# Altium project ZYNQ-HS-DEV.PrjPcb (part 4 of 4)

## Sheet ZHSD-POWER.SchDoc
size 420 x 297 mm; DocumentNumber: 1; SheetNumber: 2; SheetTotal: 17; Size: A3
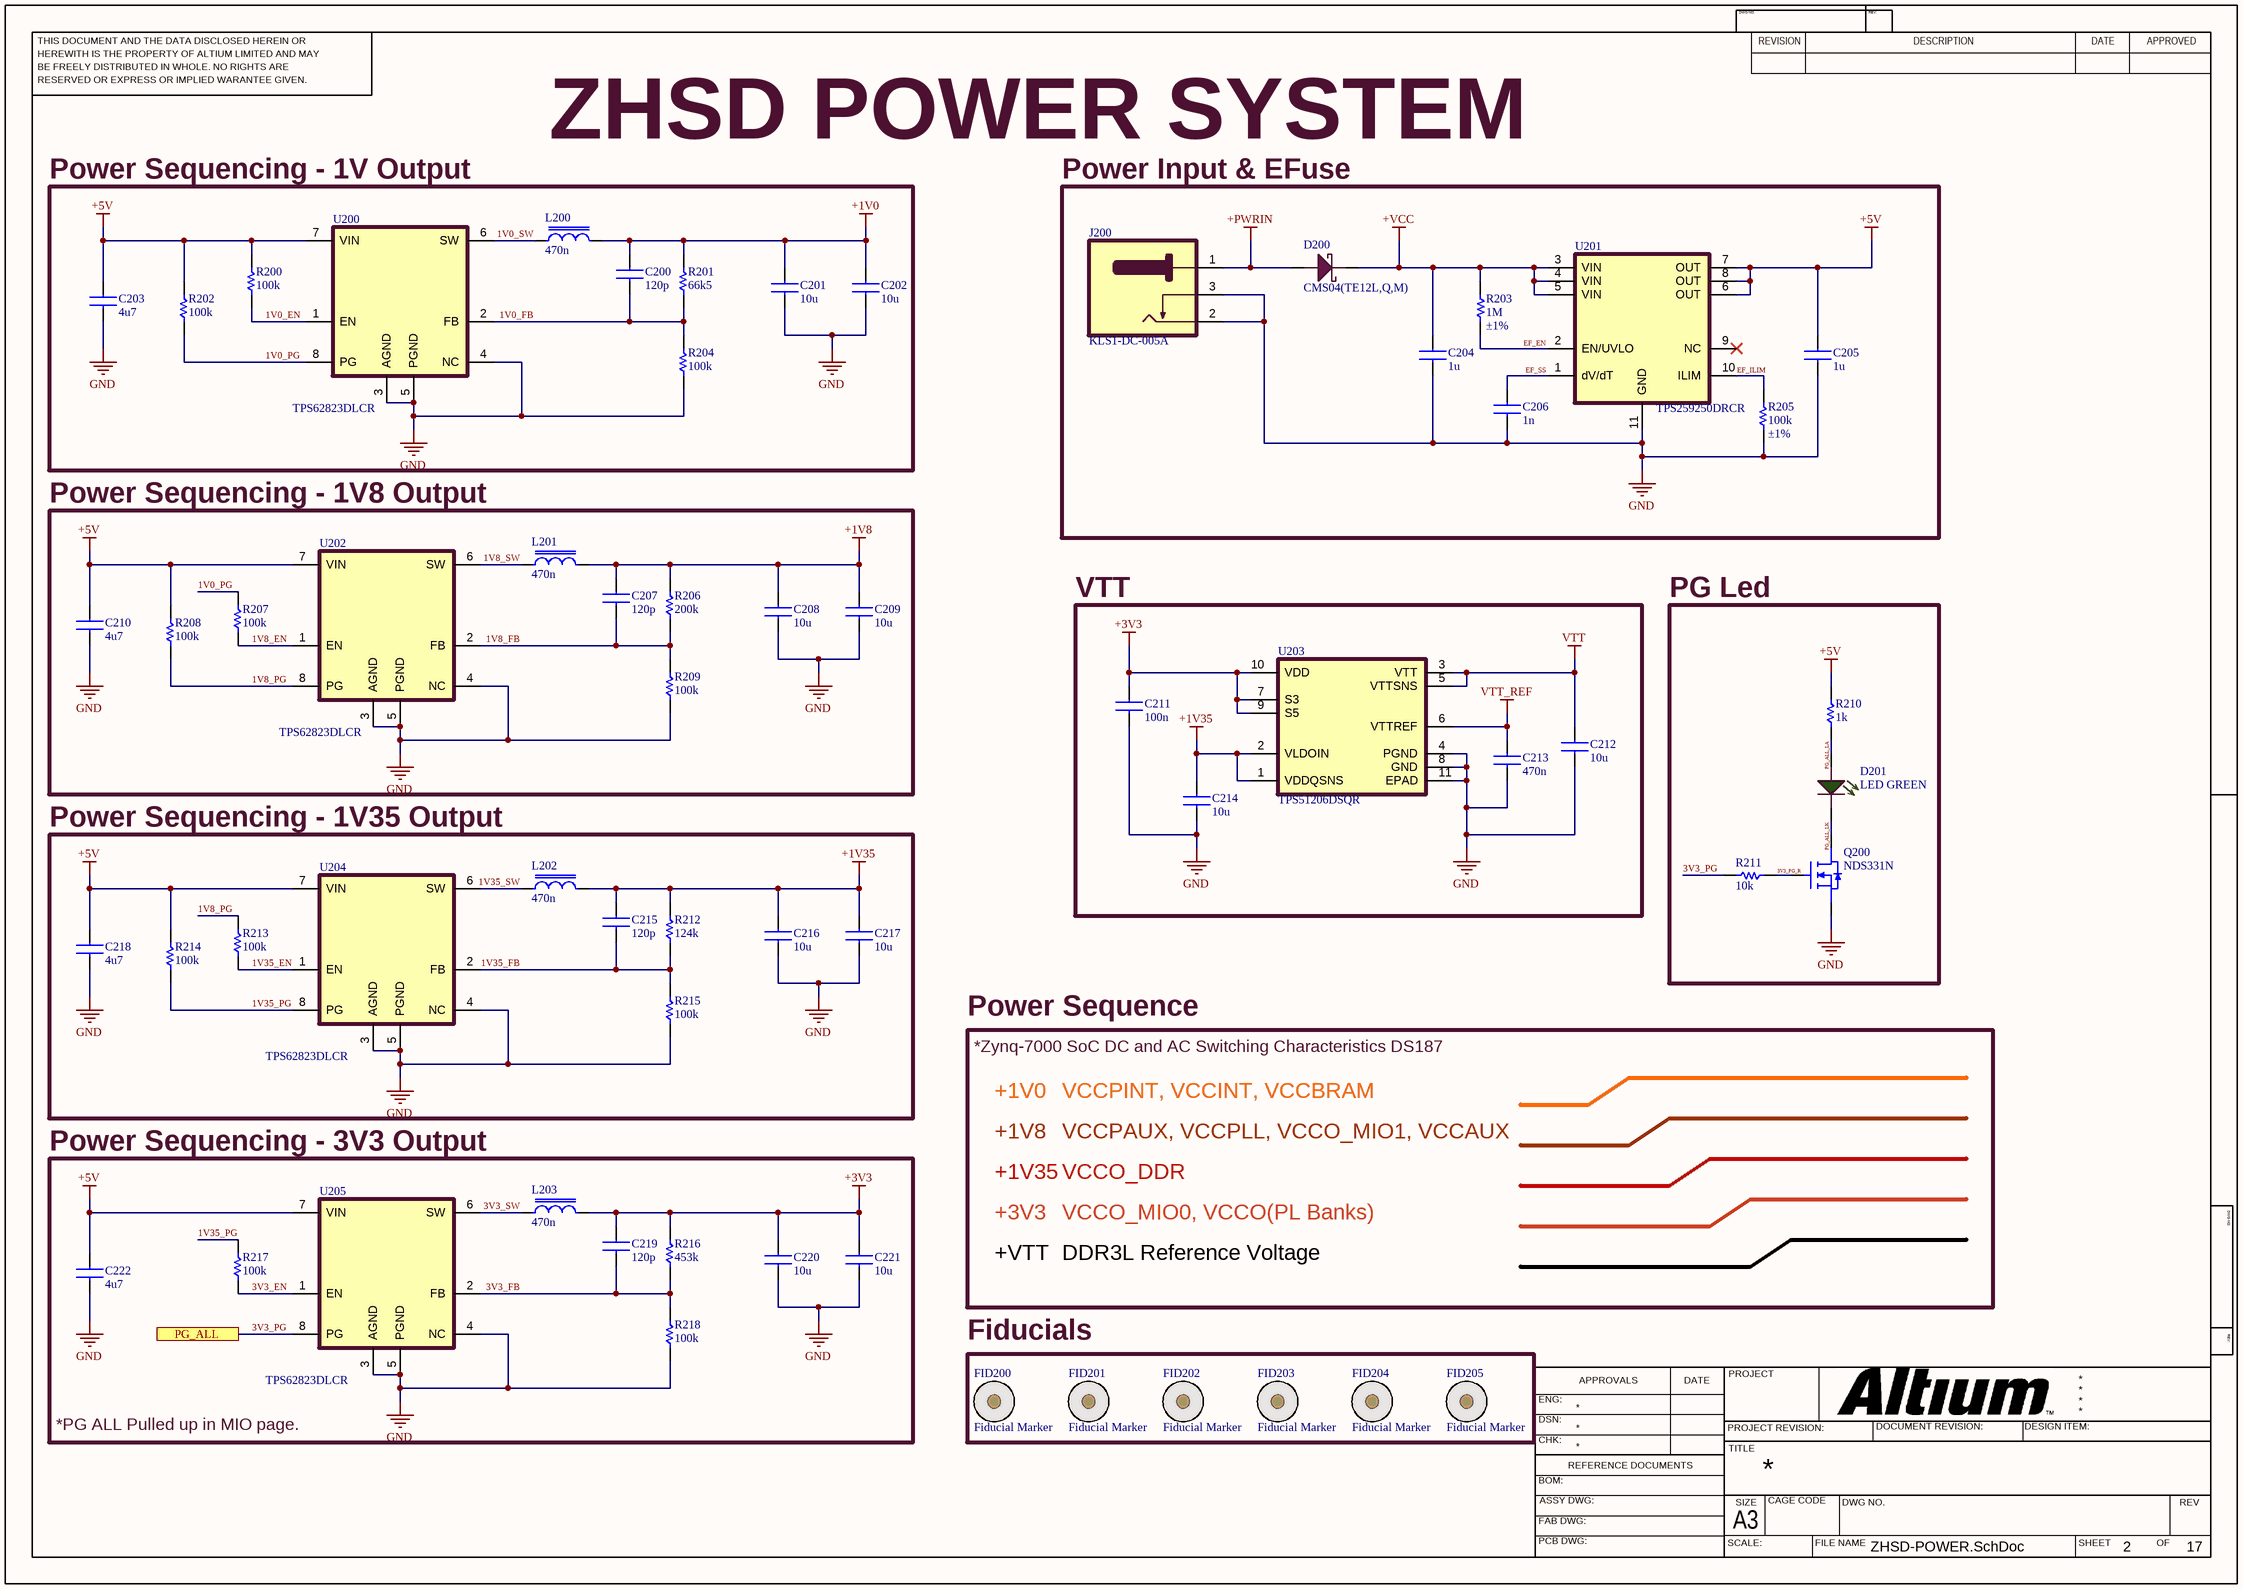
[diagram p15: ZHSD-POWER.SchDoc]

### Parts
C200  120p  [0603CAPC1608X09N]
C201  10u  [0603CAPC1608X09N]
C202  10u  [0603CAPC1608X09N]
C203  4u7  [0805CAPC2012X14N]
C204  1u  [0603CAPC1608X09N]
C205  1u  [0603CAPC1608X09N]
C206  1n  [0603CAPC1608X09N]
C207  120p  [0603CAPC1608X09N]
C208  10u  [0603CAPC1608X09N]
C209  10u  [0603CAPC1608X09N]
C210  4u7  [0805CAPC2012X14N]
C211  100n  [0402CAPC1005X06N]
C212  10u  [0603CAPC1608X09N]
C213  470n  [0402CAPC1005X06N]
C214  10u  [0603CAPC1608X09N]
C215  120p  [0603CAPC1608X09N]
C216  10u  [0603CAPC1608X09N]
C217  10u  [0603CAPC1608X09N]
C218  4u7  [0805CAPC2012X14N]
C219  120p  [0603CAPC1608X09N]
C220  10u  [0603CAPC1608X09N]
C221  10u  [0603CAPC1608X09N]
C222  4u7  [0805CAPC2012X14N]
D200  CMS04(TE12L,Q,M)  [SOD-128]
D201  LED GREEN  [0603_LED_1608N]
FID200  Fiducial Marker  [Fiducial]
FID201  Fiducial Marker  [Fiducial]
FID202  Fiducial Marker  [Fiducial]
FID203  Fiducial Marker  [Fiducial]
FID204  Fiducial Marker  [Fiducial]
FID205  Fiducial Marker  [Fiducial]
J200  KLS1-DC-005A  [CONN-KLS1-DC-005A]
L200  470n  [0806INDC2016X10N]
L201  470n  [0806INDC2016X10N]
L202  470n  [0806INDC2016X10N]
L203  470n  [0806INDC2016X10N]
Q200  NDS331N  [SOT95P251X112-3N]
R200  100k  [0603RESC1608X05L]
R201  66k5  [0603RESC1608X05N]
R202  100k  [0603RESC1608X05L]
R203  1M  Tolerance: ±1%  [0603RESC1608X05N]
R204  100k  [0603RESC1608X05L]
R205  100k  Tolerance: ±1%  [0603RESC1608X05L]
R206  200k  [0603RESC1608X05N]
R207  100k  [0603RESC1608X05L]
R208  100k  [0603RESC1608X05L]
R209  100k  [0603RESC1608X05L]
R210  1k  [0402RESC1005X04N]
R211  10k  [0603RESC1608X05N]
R212  124k  [0603RESC1608X05N]
R213  100k  [0603RESC1608X05L]
R214  100k  [0603RESC1608X05L]
R215  100k  [0603RESC1608X05L]
R216  453k  [0603RESC1608X05N]
R217  100k  [0603RESC1608X05L]
R218  100k  [0603RESC1608X05L]
U200  TPS62823DLCR  [VSON50P150X100-8N]
U201  TPS259250DRCR  [VSON50P300X100_HS-11N]
U202  TPS62823DLCR  [VSON50P150X100-8N]
U203  TPS51206DSQR  [WSON2X2-10/SON40P200X80_HS-11N]
U204  TPS62823DLCR  [VSON50P150X100-8N]
U205  TPS62823DLCR  [VSON50P150X100-8N]

### Blocks framed on the sheet
Power Sequencing - 1V Output: C200-C203 L200 R200-R202 R204 U200
Power Input & EFuse: C204-C206 D200 J200 R203 R205 U201
Power Sequencing - 1V8 Output: C207-C210 L201 R206-R209 U202
VTT: C211-C214 U203
PG Led: D201 Q200 R210 R211
Power Sequencing - 1V35 Output: C215-C218 L202 R212-R215 U204
Power Sequencing - 3V3 Output: C219-C222 L203 R216-R218 U205
Fiducials: FID200-FID205

### Ports
PG_ALL (see ZHSD-Block[116.34,200.78], ZHSD-ZYNQ-MIO[286.94,219.28])

### Nets
+1V0: C200.2 C201.2 C202.2 L200.2 R201.2
+1V8: C207.2 C208.2 C209.2 L201.2 R206.2
+1V35: C214.2 C215.2 C216.2 C217.2 L202.2 R212.2 U203.1(VDDQSNS) U203.2(VLDOIN)
+3V3: C211.2 C219.2 C220.2 C221.2 L203.2 R216.2 U203.7(S3) U203.9(S5) U203.10(VDD)
+5V: C203.2 C205.2 C210.2 C218.2 C222.2 R200.2 R202.2 R208.2 R210.2 R214.2 U200.7(VIN) U201.6(OUT) U201.7(OUT) U201.8(OUT) U202.7(VIN) U204.7(VIN) U205.7(VIN)
+PWRIN: D200.A J200.1(VCC)
+VCC: C204.2 D200.C R203.1 U201.3(VIN) U201.4(VIN) U201.5(VIN)
GND: C201.1 C202.1 C203.1 C204.1 C205.1 C206.1 C208.1 C209.1 C210.1 C211.1 C212.1 C213.1 C214.1 C216.1 C217.1 C218.1 C220.1 C221.1 C222.1 J200.2(GND) J200.3(SH) Q200.2(S) R204.1 R205.1 R209.1 R215.1 R218.1 U200.3(AGND) U200.4(NC) U200.5(PGND) U201.11(GND) U202.3(AGND) U202.4(NC) U202.5(PGND) U203.4(PGND) U203.8(GND) U203.11(EPAD) U204.3(AGND) U204.4(NC) U204.5(PGND) U205.3(AGND) U205.4(NC) U205.5(PGND)
VTT: C212.2 U203.3(VTT) U203.5(VTTSNS)
VTT_REF: C213.2 U203.6(VTTREF)
1V0_EN: R200.1 U200.1(EN)
1V0_FB: C200.1 R201.1 R204.2 U200.2(FB)
1V0_PG: R202.1 R207.2 U200.8(PG)
1V0_SW: L200.1 U200.6(SW)
1V8_EN: R207.1 U202.1(EN)
1V8_FB: C207.1 R206.1 R209.2 U202.2(FB)
1V8_PG: R208.1 R213.2 U202.8(PG)
1V8_SW: L201.1 U202.6(SW)
1V35_EN: R213.1 U204.1(EN)
1V35_FB: C215.1 R212.1 R215.2 U204.2(FB)
1V35_PG: R214.1 R217.2 U204.8(PG)
1V35_SW: L202.1 U204.6(SW)
3V3_EN: R217.1 U205.1(EN)
3V3_FB: C219.1 R216.1 R218.2 U205.2(FB)
3V3_PG: R211.2 U205.8(PG) ; port PG_ALL
3V3_PG_R: Q200.1(G) R211.1
3V3_SW: L203.1 U205.6(SW)
EF_EN: R203.2 U201.2(EN/UVLO)
EF_ILIM: R205.2 U201.10(ILIM)
EF_SS: C206.2 U201.1(dV/dT)
PG_ALL_LA: D201.1(A) R210.1
PG_ALL_LK: D201.2(C) Q200.3(D)

Not connected (* = marked no-connect by the designer): U201 9(NC)*

### Notes on the sheet
- ZHSD POWER SYSTEM
- Power Sequence
- *Zynq-7000 SoC DC and AC Switching Characteristics DS187
- +1V0
- +1V8
- VCCPINT, VCCINT, VCCBRAM
- VCCPAUX, VCCPLL, VCCO_MIO1, VCCAUX
- +1V35
- VCCO_DDR
- +3V3
- +VTT
- VCCO_MIO0, VCCO(PL Banks)
- DDR3L Reference Voltage
- *PG ALL Pulled up in MIO page.
- THIS DOCUMENT AND THE DATA DISCLOSED HEREIN OR
- HEREWITH IS THE PROPERTY OF ALTIUM LIMITED AND MAY
- DWG NO:
- REVISION
- REV:
- DESCRIPTION
- DATE
- APPROVED
- BE FREELY DISTRIBUTED IN WHOLE. NO RIGHTS ARE
- RESERVED OR EXPRESS OR IMPLIED WARANTEE GIVEN.
- ENG:
- APPROVALS
- PROJECT
- DSN:
- CHK:
- REFERENCE DOCUMENTS
- PROJECT REVISION:
- TITLE
- DOCUMENT REVISION:
- DESIGN ITEM:
- BOM:
- FAB DWG:
- PCB DWG:
- ASSY DWG:
- SCALE:
- A3
- SIZE
- CAGE CODE
- FILE NAME
- DWG NO.
- SHEET
- OF
- REV

### Library data of the parts
C200 C207 C215 C219 = GRM1885C1H121JA01D: CAP CER 120PF 50V C0G/NP0 0603 (1608) ±5%; Manufacturer: Murata Electronics; ComponentLink1Description: Datasheet; ComponentLink1URL: https://search.murata.co.jp/Ceramy/image/img/A01X/G101/ENG/GRM1885C1H121JA01-01.pdf; MPN: GRM1885C1H121JA01D; Package: 0603; Tolerance: ±5%; Value: 120 pF; Voltage: 50V
C201 C202 C208 C209 C212 C214 C216 C217 C220 C221 = GRM188Z71A106MA73D: CAP CER 10UF 10V X7R 0603 (1608) ±20%; Manufacturer: Murata Electronics; Value: 10 µF; ComponentLink1Description: Datasheet; ComponentLink1URL: https://search.murata.co.jp/Ceramy/image/img/A01X/G101/ENG/GRM188Z71A106MA73-01A.pdf; MPN: GRM188Z71A106MA73D; Package: 0603; Tolerance: ±20%; Voltage: 10V
C203 C210 C218 C222 = GRM21BR71A475KE51L: CAP CER 4.7UF 10V X7R 0805 (2012) ±10%; Manufacturer: Murata Electronics; Value: 4.7 µF; ComponentLink1Description: Datasheet; ComponentLink1URL: https://search.murata.co.jp/Ceramy/image/img/A01X/G101/ENG/GRM21BR71A475KE51-01.pdf; MPN: GRM21BR71A475KE51L; Package: 0805; Tolerance: ±10%; Voltage: 10V
C204 C205 = GRM188R61E105KA12D: CAP CER 1UF 25V X5R 0603 (1608) ±10%; Manufacturer: Murata Power Solutions Inc.; Value: 1 µF; ComponentLink1Description: Datasheet; ComponentLink1URL: https://search.murata.co.jp/Ceramy/image/img/A01X/G101/ENG/GRM188R61E105KA12-01.pdf; MPN: GRM188R61E105KA12D; Package: 0603; Tolerance: ±10%; Voltage: 25V
C206 = GCM188R71H102KA37D: CAP CER 1000PF 50V X7R 0603 (1608) ±10%; Manufacturer: Murata Electronics; ComponentLink1Description: Datasheet; ComponentLink1URL: https://search.murata.co.jp/Ceramy/image/img/A01X/G101/ENG/GCM188R71H102KA37-01.pdf; MPN: GCM188R71H102KA37D; Package: 0603; Tolerance: ±10%; Value: 1000 pF; Voltage: 50V
C211 = GRM155R71C104KA88J: CAP CER 0.1UF 16V X7R 0402 (1005) ±10%; Manufacturer: Murata Electronics; Value: 0.1 µF; ComponentLink1Description: Datasheet; ComponentLink1URL: https://search.murata.co.jp/Ceramy/image/img/A01X/G101/ENG/GRM155R71C104KA88-01.pdf; MPN: GRM155R71C104KA88J; Package: 0402; Tolerance: ±10%; Voltage: 16V
C213 = GRM155R60J474KE19D: CAP CER 0.47UF 6.3V X5R 0402(1005) ±10%; Manufacturer: Murata Electronics; Value: 0.47 µF; ComponentLink1Description: Datasheet; ComponentLink1URL: https://search.murata.co.jp/Ceramy/image/img/A01X/G101/ENG/GRM21BR71A475KE51-01.pdf; MPN: GRM155R60J474KE19D; Package: 0402; Tolerance: ±10%; Voltage: 6.3V
D200 = CMS04: Diode 30 V 5A Surface Mount M-FLAT (2.4x3.8); Manufacturer: Toshiba Semiconductor and Storage; ComponentLink1Description: Datasheet; ComponentLink1URL: https://toshiba.semicon-storage.com/info/CMS04_datasheet_en_20180911.pdf?did=3133&prodName=CMS04; MPN: CMS04(TE12L,Q; Package: SOD-123
D201 = LTST-C191TGKT: as D1400-D1402 on sheet ZHSD-ZYNQ-PL; ComponentLink1Description: Datasheet; ComponentLink1URL: https://optoelectronics.liteon.com/upload/download/DS22-2000-300/LTST-C191TGKT.PDF; MPN: LTST-C191TGKT; Package: 0603
FID200-FID205 = Fiducial_Marker: Fiducial Marker 1mm No Bom
J200 = KLS1-DC-005A: CONNECTOR DC JACK POWER PCB TYPE 2.50MM KLS; Manufacturer: KLS ELECTRONIC; MPN: L-KLS1-DC-005A-2.0; ComponentLink1Description: Datasheet; ComponentLink1URL: https://www.ozdisan.com/api/pdf/product/assets/KLS1-DC-005A.pdf
L200-L203 = DFE201610E-R47M=P2: FIXED IND 470NH 3.6A 32 MOHM SMD 0806 (2016 Metric); Manufacturer: Murata Electronics; DC Resistance (DCR) (Max): 32mOhm; Current - Saturation (Isat): 4.8A; ComponentLink1Description: Datasheet; ComponentLink1URL: https://pim.murata.com/asset/pim4/inductor/J(E)TE243A-0001_PDF_INDUCTOR?lastModifiedDatetime=20250708072022; ComponentLink2Description: Website; ComponentLink2URL: https://pim.murata.com/en-global/pim/details/?partNum=DFE201610E-R47M%23; Current Rating (Max): 3.6 A; Inductance: 470 nH; MPN: DFE201610E-R47M=P2; Package: 0806
Q200 = NDS331N: N-Channel 20 V 1.3A (Ta) 500mW (Ta) Surface Mount SOT-23-3; Manufacturer: onsemi; Drain to Source Voltage (Vdss): 20 V; Rds On (Max) @ Id, Vgs: 160mOhm @ 1.5A, 4.5V; Vgs (Max): ±8V; ComponentLink1Description: Datasheet; ComponentLink1URL: https://www.onsemi.com/pdf/datasheet/nds331n-d.pdf; MPN: NDS331N; Package: SOT-23-3
R200 R202 R204 R205 R207-R209 R213-R215 R217 R218 = CRCW0603100KFKEA: RES SMD 100K OHM 1% 1/8W 0603 (1608); Manufacturer: Vishay Dale; Value: 100 kOhms; Voltage: 75V; ComponentLink1Description: Datasheet; ComponentLink1URL: https://www.vishay.com/docs/20035/dcrcwe3.pdf; MPN: CRCW0603100KFKEA; Package: 0603
  R200 R202 R204 R207-R209 R213-R215 R217 R218: Tolerance: ±1%
R201 = CRCW060366K5FKEA: RES SMD 66.5K OHM 1% 1/8W 0603 (1608); Manufacturer: Vishay Dale; Value: 66.5 kOhms; Voltage: 75V; ComponentLink1Description: Datasheet; ComponentLink1URL: https://www.vishay.com/docs/20035/dcrcwe3.pdf; MPN: CRCW060366K5FKEA; Tolerance: ±1%; Package: 0603
R203 = CRCW06031M00FKEA: RES SMD 1M OHM 1% 1/8W 0603 (1608); Manufacturer: Vishay Dale; Value: 1 MOhms; Voltage: 75V; ComponentLink1Description: Datasheet; ComponentLink1URL: https://www.vishay.com/docs/20035/dcrcwe3.pdf; MPN: CRCW06031M00FKEA; Package: 0603
R206 = CRCW0603200KFKEBC: RES 200K OHM 1% 1/10W 0603 (1608); Manufacturer: Vishay Dale; Value: 200 kOhms; Voltage: 75V; ComponentLink1Description: Datasheet; ComponentLink1URL: https://www.vishay.com/docs/28773/crcwce3.pdf; MPN: CRCW0603200KFKEBC; Tolerance: ±1%; Package: 0603
R210 = RC0402JR-071KL: as R1400-R1402 on sheet ZHSD-ZYNQ-PL; ComponentLink1Description: Datasheet; ComponentLink1URL: https://yageogroup.com/content/datasheet/asset/file/PYU-RT_1-TO-0-01_ROHS_L; MPN: RC0402JR-071KL; Tolerance: ±5%; Package: 0402
R211 = RC0603FR-0710KL: as R1403-R1406 on sheet ZHSD-ZYNQ-PL; ComponentLink1Description: Datasheet; ComponentLink1URL: https://yageogroup.com/content/datasheet/asset/file/PYU-RC_GROUP_51_ROHS_L; MPN: RC0603FR-0710KL; Tolerance: ±1%; Package: 0603
R212 = CRCW0603124KFKEA: RES SMD 124K OHM 1% 1/8W 0603 (1608); Manufacturer: Vishay Dale; Value: 124 kOhms; Voltage: 75V; ComponentLink1Description: Datasheet; ComponentLink1URL: https://www.vishay.com/docs/20035/dcrcwe3.pdf; MPN: CRCW0603124KFKEA; Tolerance: ±1%; Package: 0603
R216 = CRCW0603453KFKEAC: RES 453K OHM 1% 1/10W 0603(1608); Manufacturer: Vishay Dale; Value: 453 kOhms; Voltage: 75V; ComponentLink1Description: Datasheet; ComponentLink1URL: https://www.vishay.com/docs/28773/crcwce3.pdf; MPN: CRCW0603453KFKEAC; Tolerance: ±1%; Package: 0603
U200 U202 U204 U205 = TPS62823DLCR: 2.4-V to 5.5-V input, 3-A step-down converter with 1% accuracy in 1.5-mm x 2-mm VSON-HR package; Manufacturer: Texas Instruments; ComponentLink1Description: Datasheet; ComponentLink1URL: https://www.ti.com/lit/ds/symlink/tps62823.pdf; ComponentLink2Description: Evaluation Module; ComponentLink2URL: https://www.ti.com/lit/ug/slvuba0/slvuba0.pdf; MPN: TPS62823DLCR
U201 = TPS259250DRCR: Electronic Fuse Regulator 5A 10-VSON (3x3); Manufacturer: Texas Instruments; ComponentLink1Description: Datasheet; ComponentLink1URL: https://www.ti.com/lit/ds/symlink/tps25925.pdf?HQS=dis-dk-null-digikeymode-dsf-pf-null-wwe&ts=1768606527240&ref_url=https%253A%252F%252Fwww.ti.com%252Fgeneral%252Fdocs%252Fsuppproductinfo.tsp%253FdistId%253D10%2526gotoUrl%253Dhttps%253A%252F%252Fwww.ti.com%252Flit%252Fgpn%252Ftps25925; ComponentLink2Description: Evaluation Module; ComponentLink2URL: https://www.ti.com/lit/ug/sluub64/sluub64.pdf?ts=1768615249837; MPN: TPS259250DRCR
U203 = TPS51206: Converter, DDR Voltage Regulator IC 1 Output 10-WSON (2x2); Manufacturer: Texas Instruments; ComponentLink1Description: Datasheet; ComponentLink1URL: https://www.ti.com/lit/ds/symlink/tps51206.pdf?HQS=dis-dk-null-digikeymode-dsf-pf-null-wwe&ts=1769211972272&ref_url=https%253A%252F%252Fwww.ti.com%252Fgeneral%252Fdocs%252Fsuppproductinfo.tsp%253FdistId%253D10%2526gotoUrl%253Dhttps%253A%252F%252Fwww.ti.com%252Flit%252Fgpn%252Ftps51206; MPN: TPS51206DSQR; Package: 10-WSON

## Sheet ZHSD-PL-CONNS.SchDoc
size 420 x 297 mm; DrawnBy: UGUR KELES; DocumentNumber: 17; SheetNumber: 17; SheetTotal: 17; Size: A4
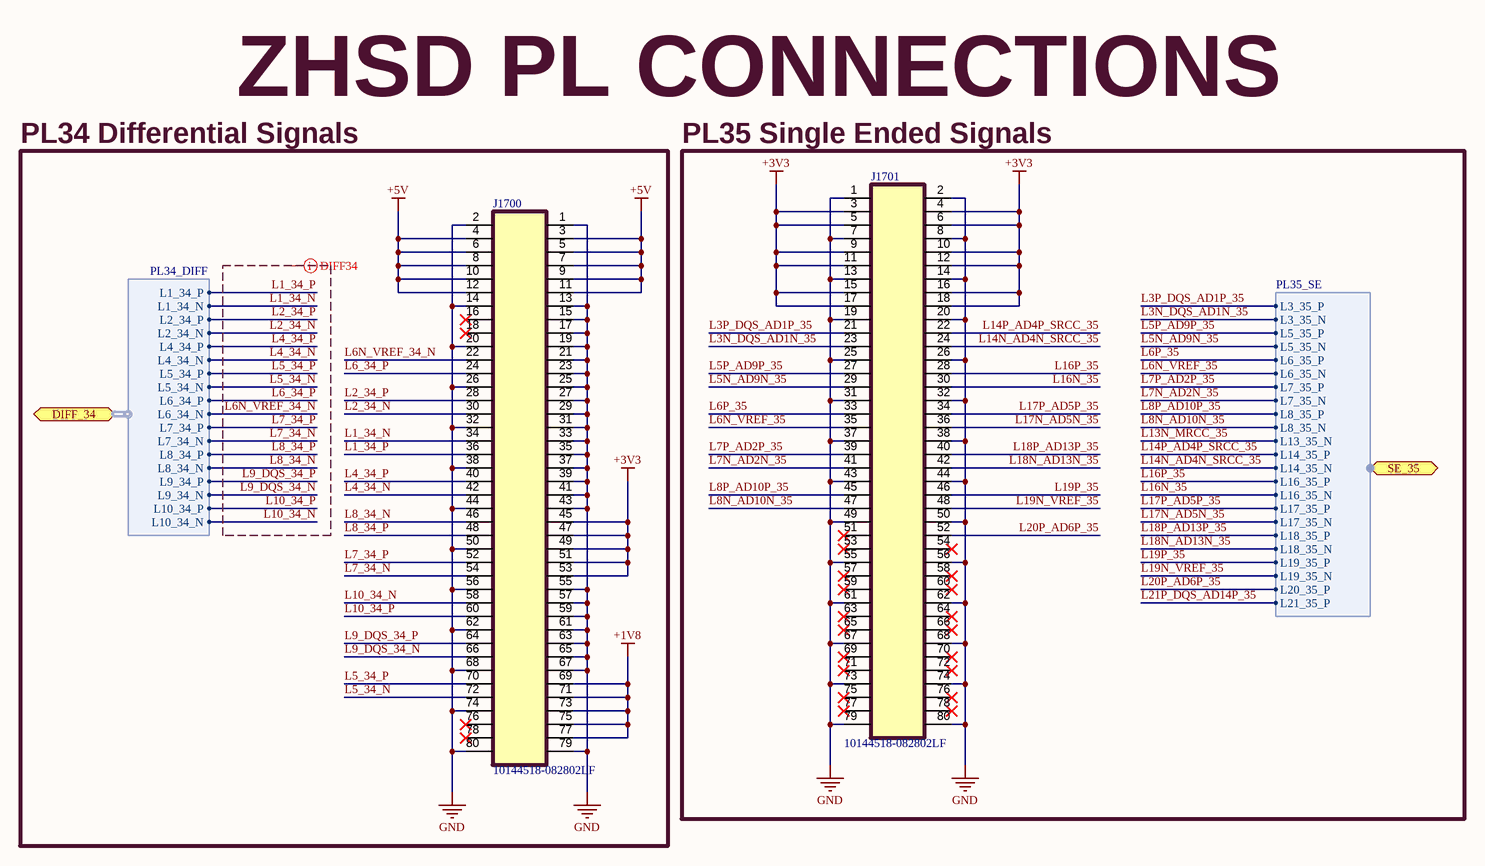
[diagram p16: ZHSD-PL-CONNS.SchDoc]

### Parts
J1700  10144518-082802LF  [10144518-082802LF]
J1701  10144518-082802LF  [10144518-082802LF]

### Blocks framed on the sheet
PL34 Differential Signals: J1700
PL35 Single Ended Signals: J1701

### Ports
DIFF_34 (bidir, harness PL34_DIFF, see ZHSD-Block[276.36,99.18], ZHSD-ZYNQ-PL[229.98,211.12]), SE_35 (bidir, harness PL35_SE, see ZHSD-Block[276.36,91.56], ZHSD-ZYNQ-PL[374.76,81.58])

### Harnesses
PL34_DIFF: L1_34_P, L1_34_N, L2_34_P, L2_34_N, L4_34_P, L4_34_N, L5_34_P, L5_34_N, L6_34_P, L6_34_N, L7_34_P, L7_34_N, L8_34_P, L8_34_N, L9_34_P, L9_34_N, L10_34_P, L10_34_N
PL35_SE: L3_35_P, L3_35_N, L5_35_P, L5_35_N, L6_35_P, L6_35_N, L7_35_P, L7_35_N, L8_35_P, L8_35_N, L13_35_N, L14_35_P, L14_35_N, L16_35_P, L16_35_N, L17_35_P, L17_35_N, L18_35_P, L18_35_N, L19_35_P, L19_35_N, L20_35_P, L21_35_P

### Nets
+1V8: J1700.69 J1700.71 J1700.73 J1700.75 J1700.77
+3V3: J1700.45 J1700.47 J1700.49 J1700.51 J1700.53 J1701.3 J1701.4 J1701.5 J1701.6 J1701.9 J1701.10 J1701.11 J1701.12 J1701.15 J1701.16 J1701.17 J1701.18
+5V: J1700.3 J1700.4 J1700.5 J1700.6 J1700.7 J1700.8 J1700.9 J1700.10 J1700.11 J1700.12
GND: J1700.1 J1700.2 J1700.13 J1700.14 J1700.15 J1700.17 J1700.19 J1700.20 J1700.21 J1700.23 J1700.25 J1700.26 J1700.27 J1700.29 J1700.31 J1700.32 J1700.33 J1700.35 J1700.37 J1700.38 J1700.39 J1700.41 J1700.43 J1700.44 J1700.50 J1700.55 J1700.56 J1700.57 J1700.59 J1700.61 J1700.62 J1700.63 J1700.65 J1700.67 J1700.68 J1700.74 J1700.79 J1700.80 J1701.1 J1701.2 J1701.7 J1701.8 J1701.13 J1701.14 J1701.19 J1701.20 J1701.25 J1701.26 J1701.31 J1701.32 J1701.37 J1701.38 J1701.43 J1701.44 J1701.49 J1701.50 J1701.55 J1701.56 J1701.61 J1701.62 J1701.67 J1701.68 J1701.73 J1701.74 J1701.79 J1701.80
L1_34_N: J1700.34 ; port DIFF_34.L1_34_N  [project net DIFF34.L1_34_N]
L1_34_P: J1700.36 ; port DIFF_34.L1_34_P  [project net DIFF34.L1_34_P]
L2_34_N: J1700.30 ; port DIFF_34.L2_34_N  [project net DIFF34.L2_34_N]
L2_34_P: J1700.28 ; port DIFF_34.L2_34_P  [project net DIFF34.L2_34_P]
L3N_DQS_AD1N_35: J1701.23 ; port SE_35.L3_35_N  [project net SE35.L3_35_N]
L3P_DQS_AD1P_35: J1701.21 ; port SE_35.L3_35_P  [project net SE35.L3_35_P]
L4_34_N: J1700.42 ; port DIFF_34.L4_34_N  [project net DIFF34.L4_34_N]
L4_34_P: J1700.40 ; port DIFF_34.L4_34_P  [project net DIFF34.L4_34_P]
L5_34_N: J1700.72 ; port DIFF_34.L5_34_N  [project net DIFF34.L5_34_N]
L5_34_P: J1700.70 ; port DIFF_34.L5_34_P  [project net DIFF34.L5_34_P]
L5N_AD9N_35: J1701.29 ; port SE_35.L5_35_N  [project net SE35.L5_35_N]
L5P_AD9P_35: J1701.27 ; port SE_35.L5_35_P  [project net SE35.L5_35_P]
L6_34_P: J1700.24 ; port DIFF_34.L6_34_P  [project net DIFF34.L6_34_P]
L6N_VREF_34_N: J1700.22 ; port DIFF_34.L6_34_N  [project net DIFF34.L6_34_N]
L6N_VREF_35: J1701.35 ; port SE_35.L6_35_N  [project net SE35.L6_35_N]
L6P_35: J1701.33 ; port SE_35.L6_35_P  [project net SE35.L6_35_P]
L7_34_N: J1700.54 ; port DIFF_34.L7_34_N  [project net DIFF34.L7_34_N]
L7_34_P: J1700.52 ; port DIFF_34.L7_34_P  [project net DIFF34.L7_34_P]
L7N_AD2N_35: J1701.41 ; port SE_35.L7_35_N  [project net SE35.L7_35_N]
L7P_AD2P_35: J1701.39 ; port SE_35.L7_35_P  [project net SE35.L7_35_P]
L8_34_N: J1700.46 ; port DIFF_34.L8_34_N  [project net DIFF34.L8_34_N]
L8_34_P: J1700.48 ; port DIFF_34.L8_34_P  [project net DIFF34.L8_34_P]
L8N_AD10N_35: J1701.47 ; port SE_35.L8_35_N  [project net SE35.L8_35_N]
L8P_AD10P_35: J1701.45 ; port SE_35.L8_35_P  [project net SE35.L8_35_P]
L9_DQS_34_N: J1700.66 ; port DIFF_34.L9_34_N  [project net DIFF34.L9_34_N]
L9_DQS_34_P: J1700.64 ; port DIFF_34.L9_34_P  [project net DIFF34.L9_34_P]
L10_34_N: J1700.58 ; port DIFF_34.L10_34_N  [project net DIFF34.L10_34_N]
L10_34_P: J1700.60 ; port DIFF_34.L10_34_P  [project net DIFF34.L10_34_P]
L13N_MRCC_35: port SE_35.L13_35_N  [project net SE35.L13_35_N]
L14N_AD4N_SRCC_35: J1701.24 ; port SE_35.L14_35_N  [project net SE35.L14_35_N]
L14P_AD4P_SRCC_35: J1701.22 ; port SE_35.L14_35_P  [project net SE35.L14_35_P]
L16N_35: J1701.30 ; port SE_35.L16_35_N  [project net SE35.L16_35_N]
L16P_35: J1701.28 ; port SE_35.L16_35_P  [project net SE35.L16_35_P]
L17N_AD5N_35: J1701.36 ; port SE_35.L17_35_N  [project net SE35.L17_35_N]
L17P_AD5P_35: J1701.34 ; port SE_35.L17_35_P  [project net SE35.L17_35_P]
L18N_AD13N_35: J1701.42 ; port SE_35.L18_35_N  [project net SE35.L18_35_N]
L18P_AD13P_35: J1701.40 ; port SE_35.L18_35_P  [project net SE35.L18_35_P]
L19N_VREF_35: J1701.48 ; port SE_35.L19_35_N  [project net SE35.L19_35_N]
L19P_35: J1701.46 ; port SE_35.L19_35_P  [project net SE35.L19_35_P]
L20P_AD6P_35: J1701.52 ; port SE_35.L20_35_P  [project net SE35.L20_35_P]
L21P_DQS_AD14P_35: port SE_35.L21_35_P  [project net SE35.L21_35_P]

Not connected (* = marked no-connect by the designer): J1700 16* 18* 76* 78*; J1701 51* 53* 54* 57* 58* 59* 60* 63* 64* 65* 66* 69* 70* 71* 72* 75* 76* 77* 78*

### Layout directives
differential pair; rule Differential Pairs Routing [Pref Gap = 10mil    Min Gap  = 5mil    Max Gap  = 10milPref Width = 3.937mil    Min Width  = 3.543mil    Max Width  = 3.937mil]: L1_34_N, L1_34_P, L2_34_N, L2_34_P, L4_34_N, L4_34_P, L5_34_N, L5_34_P, L6_34_P, L6N_VREF_34_N, L7_34_N, L7_34_P, L8_34_N, L8_34_P, L9_DQS_34_N, L9_DQS_34_P, L10_34_N, L10_34_P

### Notes on the sheet
- ZHSD PL CONNECTIONS
- THIS DOCUMENT AND THE DATA DISCLOSED HEREIN OR
- HEREWITH IS THE PROPERTY OF ALTIUM LIMITED AND MAY
- DWG NO:
- REVISION
- REV:
- DESCRIPTION
- DATE
- APPROVED
- BE FREELY DISTRIBUTED IN WHOLE. NO RIGHTS ARE
- RESERVED OR EXPRESS OR IMPLIED WARANTEE GIVEN.
- ENG:
- APPROVALS
- PROJECT
- DSN:
- CHK:
- REFERENCE DOCUMENTS
- PROJECT REVISION:
- TITLE
- DOCUMENT REVISION:
- DESIGN ITEM:
- BOM:
- FAB DWG:
- PCB DWG:
- ASSY DWG:
- SCALE:
- A3
- SIZE
- CAGE CODE
- FILE NAME
- DWG NO.
- SHEET
- OF
- REV

### Library data of the parts
J1700 J1701 = 10144518-082802LF: BergStak® Lite 0.80mm, Board-to-Board Connector, 80 Positions, Dual Row, Vertical Header; Manufacturer: Amphenol; MPN: 10144518-082802LF

## Nets that join several sheets
+1V0: ZHSD-ZYNQ-PWR (32 pins), ZHSD-POWER (5 pins)
+1V8: ZHSD-ZYNQ-CONFIG (U300.F11 U300.J9), ZHSD-ZYNQ-PWR (25 pins), ZHSD-ZYNQ-MIO (10 pins), ZHSD-USB-OTG (8 pins), ZHSD-ETHERNET (C1110.2 C1111.2 FB1101.1), ZHSD-USB-UART (Q1200.1 Q1201.1 R1201.1 R1204.1), ZHSD-RS485-CAN (7 pins), ZHSD-HDMI (FB1501.1 FB1502.1 FB1503.1), ZHSD-POWER (5 pins), ZHSD-PL-CONNS (5 pins)
+1V35: ZHSD-ZYNQ-PWR (16 pins), ZHSD-ZYNQ-DDR (R625.2), ZHSD-DDR3L (76 pins), ZHSD-POWER (8 pins)
+3V3: ZHSD-ZYNQ-CONFIG (10 pins), ZHSD-JTAG (C516.2 J501.6), ZHSD-ZYNQ-PWR (44 pins), ZHSD-BOOT-STORAGE (34 pins), ZHSD-ZYNQ-MIO (9 pins), ZHSD-USB-OTG (9 pins), ZHSD-ETHERNET (13 pins), ZHSD-RS485-CAN (6 pins), ZHSD-ZYNQ-PL (7 pins), ZHSD-HDMI (8 pins), ZHSD-MIPI-CSI2 (J1600.15 R1604.2 R1605.2), ZHSD-POWER (9 pins), ZHSD-PL-CONNS (17 pins)
+5V: ZHSD-USB-OTG (C1007.2 U1001.5), ZHSD-RS485-CAN (5 pins), ZHSD-HDMI (C1511.2 J1500.18 R1503.2 R1504.2), ZHSD-POWER (17 pins), ZHSD-PL-CONNS (10 pins)
CHASSIS: ZHSD-JTAG (J500.SH), ZHSD-ZYNQ-PWR (C357.2 R300.1), ZHSD-USB-OTG (J1000.SH), ZHSD-ETHERNET (J1100.SH), ZHSD-USB-UART (J1200.SH), ZHSD-HDMI (J1500.S1 J1500.S2 J1500.S3 J1500.S4)
GND: ZHSD-ZYNQ-CONFIG (10 pins), ZHSD-JTAG (39 pins), ZHSD-ZYNQ-PWR (118 pins), ZHSD-BOOT-STORAGE (31 pins), ZHSD-ZYNQ-MIO (19 pins), ZHSD-USB-OTG (20 pins), ZHSD-ETHERNET (27 pins), ZHSD-USB-UART (12 pins), ZHSD-RS485-CAN (13 pins), ZHSD-ZYNQ-PL (9 pins), ZHSD-HDMI (86 pins), ZHSD-MIPI-CSI2 (J1600.1 J1600.4 J1600.7 J1600.10), ZHSD-ZYNQ-DDR (15 pins), ZHSD-DDR3L (86 pins), ZHSD-POWER (43 pins), ZHSD-PL-CONNS (66 pins)
VTT: ZHSD-ZYNQ-DDR (35 pins), ZHSD-POWER (C212.2 U203.3 U203.5)
VTT_REF: ZHSD-ZYNQ-DDR (C600.2 C601.2 U300.H6 U300.P6), ZHSD-DDR3L (6 pins), ZHSD-POWER (C213.2 U203.6)
3V3_PG: ZHSD-ZYNQ-MIO (C802.2 R801.1 U800.2), ZHSD-POWER (R211.2 U205.8)
CAM_CLK: ZHSD-ZYNQ-PL (U300.U9), ZHSD-MIPI-CSI2 (J1600.12)
CAM_GPIO: ZHSD-ZYNQ-PL (U300.U7), ZHSD-MIPI-CSI2 (J1600.11)
CAM_SCL: ZHSD-ZYNQ-PL (U300.T5), ZHSD-MIPI-CSI2 (J1600.13 R1605.1)
CAM_SDA: ZHSD-ZYNQ-PL (U300.U5), ZHSD-MIPI-CSI2 (J1600.14 R1604.1)
DDR_A0: ZHSD-ZYNQ-DDR (R600.2 U300.N2), ZHSD-DDR3L (U700.N3 U701.N3)
DDR_A1: ZHSD-ZYNQ-DDR (R601.2 U300.K2), ZHSD-DDR3L (U700.P7 U701.P7)
DDR_A2: ZHSD-ZYNQ-DDR (R602.2 U300.M3), ZHSD-DDR3L (U700.P3 U701.P3)
DDR_A3: ZHSD-ZYNQ-DDR (R603.2 U300.K3), ZHSD-DDR3L (U700.N2 U701.N2)
DDR_A4: ZHSD-ZYNQ-DDR (R604.2 U300.M4), ZHSD-DDR3L (U700.P8 U701.P8)
DDR_A5: ZHSD-ZYNQ-DDR (R605.2 U300.L1), ZHSD-DDR3L (U700.P2 U701.P2)
DDR_A6: ZHSD-ZYNQ-DDR (R606.2 U300.L4), ZHSD-DDR3L (U700.R8 U701.R8)
DDR_A7: ZHSD-ZYNQ-DDR (R607.2 U300.K4), ZHSD-DDR3L (U700.R2 U701.R2)
DDR_A8: ZHSD-ZYNQ-DDR (R608.2 U300.K1), ZHSD-DDR3L (U700.T8 U701.T8)
DDR_A9: ZHSD-ZYNQ-DDR (R609.2 U300.J4), ZHSD-DDR3L (U700.R3 U701.R3)
DDR_A10: ZHSD-ZYNQ-DDR (R610.2 U300.F5), ZHSD-DDR3L (U700.L7 U701.L7)
DDR_A11: ZHSD-ZYNQ-DDR (R611.2 U300.G4), ZHSD-DDR3L (U700.R7 U701.R7)
DDR_A12: ZHSD-ZYNQ-DDR (R612.2 U300.E4), ZHSD-DDR3L (U700.N7 U701.N7)
DDR_A13: ZHSD-ZYNQ-DDR (R613.2 U300.D4), ZHSD-DDR3L (U700.T3 U701.T3)
DDR_A14: ZHSD-ZYNQ-DDR (R614.2 U300.F4), ZHSD-DDR3L (U700.T7 U701.T7)
DDR_BA0: ZHSD-ZYNQ-DDR (R615.2 U300.L5), ZHSD-DDR3L (U700.M2 U701.M2)
DDR_BA1: ZHSD-ZYNQ-DDR (R616.2 U300.R4), ZHSD-DDR3L (U700.N8 U701.N8)
DDR_BA2: ZHSD-ZYNQ-DDR (R617.2 U300.J5), ZHSD-DDR3L (U700.M3 U701.M3)
DDR_CAS_B: ZHSD-ZYNQ-DDR (R620.2 U300.P5), ZHSD-DDR3L (U700.K3 U701.K3)
DDR_CK_N: ZHSD-ZYNQ-DDR (R624.1 U300.M2), ZHSD-DDR3L (U700.K7 U701.K7)
DDR_CK_P: ZHSD-ZYNQ-DDR (R624.2 U300.L2), ZHSD-DDR3L (U700.J7 U701.J7)
DDR_CKE: ZHSD-ZYNQ-DDR (R623.2 U300.N3), ZHSD-DDR3L (U700.K9 U701.K9)
DDR_CS_B: ZHSD-ZYNQ-DDR (R618.2 U300.N1), ZHSD-DDR3L (U700.L2 U701.L2)
DDR_DM0: ZHSD-ZYNQ-DDR (U300.A1), ZHSD-DDR3L (U700.E7)
DDR_DM1: ZHSD-ZYNQ-DDR (U300.F1), ZHSD-DDR3L (U700.D3)
DDR_DM2: ZHSD-ZYNQ-DDR (U300.T1), ZHSD-DDR3L (U701.E7)
DDR_DM3: ZHSD-ZYNQ-DDR (U300.Y1), ZHSD-DDR3L (U701.D3)
DDR_DQ0: ZHSD-ZYNQ-DDR (U300.C3), ZHSD-DDR3L (U700.A3)
DDR_DQ1: ZHSD-ZYNQ-DDR (U300.B3), ZHSD-DDR3L (U700.A2)
DDR_DQ2: ZHSD-ZYNQ-DDR (U300.A2), ZHSD-DDR3L (U700.C3)
DDR_DQ3: ZHSD-ZYNQ-DDR (U300.A4), ZHSD-DDR3L (U700.C2)
DDR_DQ4: ZHSD-ZYNQ-DDR (U300.D3), ZHSD-DDR3L (U700.B8)
DDR_DQ5: ZHSD-ZYNQ-DDR (U300.D1), ZHSD-DDR3L (U700.C8)
DDR_DQ6: ZHSD-ZYNQ-DDR (U300.C1), ZHSD-DDR3L (U700.A7)
DDR_DQ7: ZHSD-ZYNQ-DDR (U300.E1), ZHSD-DDR3L (U700.D7)
DDR_DQ8: ZHSD-ZYNQ-DDR (U300.E2), ZHSD-DDR3L (U700.F2)
DDR_DQ9: ZHSD-ZYNQ-DDR (U300.E3), ZHSD-DDR3L (U700.H3)
DDR_DQ10: ZHSD-ZYNQ-DDR (U300.G3), ZHSD-DDR3L (U700.G2)
DDR_DQ11: ZHSD-ZYNQ-DDR (U300.H3), ZHSD-DDR3L (U700.F7)
DDR_DQ12: ZHSD-ZYNQ-DDR (U300.J3), ZHSD-DDR3L (U700.E3)
DDR_DQ13: ZHSD-ZYNQ-DDR (U300.H2), ZHSD-DDR3L (U700.H7)
DDR_DQ14: ZHSD-ZYNQ-DDR (U300.H1), ZHSD-DDR3L (U700.H8)
DDR_DQ15: ZHSD-ZYNQ-DDR (U300.J1), ZHSD-DDR3L (U700.F8)
DDR_DQ16: ZHSD-ZYNQ-DDR (U300.P1), ZHSD-DDR3L (U701.G2)
DDR_DQ17: ZHSD-ZYNQ-DDR (U300.P3), ZHSD-DDR3L (U701.H3)
DDR_DQ18: ZHSD-ZYNQ-DDR (U300.R3), ZHSD-DDR3L (U701.F2)
DDR_DQ19: ZHSD-ZYNQ-DDR (U300.R1), ZHSD-DDR3L (U701.E3)
DDR_DQ20: ZHSD-ZYNQ-DDR (U300.T4), ZHSD-DDR3L (U701.H7)
DDR_DQ21: ZHSD-ZYNQ-DDR (U300.U4), ZHSD-DDR3L (U701.H8)
DDR_DQ22: ZHSD-ZYNQ-DDR (U300.U2), ZHSD-DDR3L (U701.F7)
DDR_DQ23: ZHSD-ZYNQ-DDR (U300.U3), ZHSD-DDR3L (U701.F8)
DDR_DQ24: ZHSD-ZYNQ-DDR (U300.V1), ZHSD-DDR3L (U701.C2)
DDR_DQ25: ZHSD-ZYNQ-DDR (U300.Y3), ZHSD-DDR3L (U701.C8)
DDR_DQ26: ZHSD-ZYNQ-DDR (U300.W1), ZHSD-DDR3L (U701.A3)
DDR_DQ27: ZHSD-ZYNQ-DDR (U300.Y4), ZHSD-DDR3L (U701.B8)
DDR_DQ28: ZHSD-ZYNQ-DDR (U300.Y2), ZHSD-DDR3L (U701.C3)
DDR_DQ29: ZHSD-ZYNQ-DDR (U300.W3), ZHSD-DDR3L (U701.A7)
DDR_DQ30: ZHSD-ZYNQ-DDR (U300.V2), ZHSD-DDR3L (U701.A2)
DDR_DQ31: ZHSD-ZYNQ-DDR (U300.V3), ZHSD-DDR3L (U701.D7)
DDR_DQS0_N: ZHSD-ZYNQ-DDR (U300.B2), ZHSD-DDR3L (U700.B7)
DDR_DQS0_P: ZHSD-ZYNQ-DDR (U300.C2), ZHSD-DDR3L (U700.C7)
DDR_DQS1_N: ZHSD-ZYNQ-DDR (U300.F2), ZHSD-DDR3L (U700.G3)
DDR_DQS1_P: ZHSD-ZYNQ-DDR (U300.G2), ZHSD-DDR3L (U700.F3)
DDR_DQS2_N: ZHSD-ZYNQ-DDR (U300.T2), ZHSD-DDR3L (U701.G3)
DDR_DQS2_P: ZHSD-ZYNQ-DDR (U300.R2), ZHSD-DDR3L (U701.F3)
DDR_DQS3_N: ZHSD-ZYNQ-DDR (U300.W4), ZHSD-DDR3L (U701.B7)
DDR_DQS3_P: ZHSD-ZYNQ-DDR (U300.W5), ZHSD-DDR3L (U701.C7)
DDR_DRST_B: ZHSD-ZYNQ-DDR (R626.2 U300.B4), ZHSD-DDR3L (U700.T2 U701.T2)
DDR_ODT: ZHSD-ZYNQ-DDR (R622.2 U300.N5), ZHSD-DDR3L (U700.K1 U701.K1)
DDR_RAS_B: ZHSD-ZYNQ-DDR (R619.2 U300.P4), ZHSD-DDR3L (U700.J3 U701.J3)
DDR_WE_B: ZHSD-ZYNQ-DDR (R621.2 U300.M5), ZHSD-DDR3L (U700.L3 U701.L3)
DIFF34.L1_34_N: ZHSD-ZYNQ-PL (U300.T10), ZHSD-PL-CONNS (J1700.34)
DIFF34.L1_34_P: ZHSD-ZYNQ-PL (U300.T11), ZHSD-PL-CONNS (J1700.36)
DIFF34.L2_34_N: ZHSD-ZYNQ-PL (U300.U12), ZHSD-PL-CONNS (J1700.30)
DIFF34.L2_34_P: ZHSD-ZYNQ-PL (U300.T12), ZHSD-PL-CONNS (J1700.28)
DIFF34.L4_34_N: ZHSD-ZYNQ-PL (U300.W13), ZHSD-PL-CONNS (J1700.42)
DIFF34.L4_34_P: ZHSD-ZYNQ-PL (U300.V12), ZHSD-PL-CONNS (J1700.40)
DIFF34.L5_34_N: ZHSD-ZYNQ-PL (U300.T15), ZHSD-PL-CONNS (J1700.72)
DIFF34.L5_34_P: ZHSD-ZYNQ-PL (U300.T14), ZHSD-PL-CONNS (J1700.70)
DIFF34.L6_34_N: ZHSD-ZYNQ-PL (U300.R14), ZHSD-PL-CONNS (J1700.22)
DIFF34.L6_34_P: ZHSD-ZYNQ-PL (U300.P14), ZHSD-PL-CONNS (J1700.24)
DIFF34.L7_34_N: ZHSD-ZYNQ-PL (U300.Y17), ZHSD-PL-CONNS (J1700.54)
DIFF34.L7_34_P: ZHSD-ZYNQ-PL (U300.Y16), ZHSD-PL-CONNS (J1700.52)
DIFF34.L8_34_N: ZHSD-ZYNQ-PL (U300.Y14), ZHSD-PL-CONNS (J1700.46)
DIFF34.L8_34_P: ZHSD-ZYNQ-PL (U300.W14), ZHSD-PL-CONNS (J1700.48)
DIFF34.L9_34_N: ZHSD-ZYNQ-PL (U300.U17), ZHSD-PL-CONNS (J1700.66)
DIFF34.L9_34_P: ZHSD-ZYNQ-PL (U300.T16), ZHSD-PL-CONNS (J1700.64)
DIFF34.L10_34_N: ZHSD-ZYNQ-PL (U300.W15), ZHSD-PL-CONNS (J1700.58)
DIFF34.L10_34_P: ZHSD-ZYNQ-PL (U300.V15), ZHSD-PL-CONNS (J1700.60)
ETH_MDC: ZHSD-ZYNQ-MIO (U300.C11), ZHSD-ETHERNET (U1100.13)
ETH_MDIO: ZHSD-ZYNQ-MIO (U300.C10), ZHSD-ETHERNET (R1113.1 U1100.14)
ETH_NINT: ZHSD-ZYNQ-MIO (U300.C17), ZHSD-ETHERNET (R1114.1 U1100.31)
ETH_PHY_NRST: ZHSD-ZYNQ-MIO (R805.1 U802.4), ZHSD-ETHERNET (U1100.12)
ETH_RX_CLK: ZHSD-ZYNQ-MIO (U300.B17), ZHSD-ETHERNET (R1109.2 R1110.2)
ETH_RX_CTL: ZHSD-ZYNQ-MIO (U300.D13), ZHSD-ETHERNET (R1108.2 R1111.2)
ETH_RXD0: ZHSD-ZYNQ-MIO (U300.D11), ZHSD-ETHERNET (R1100.1 R1104.2)
ETH_RXD1: ZHSD-ZYNQ-MIO (U300.A16), ZHSD-ETHERNET (R1101.1 R1105.2)
ETH_RXD2: ZHSD-ZYNQ-MIO (U300.F15), ZHSD-ETHERNET (R1102.1 R1106.2 R1112.2)
ETH_RXD3: ZHSD-ZYNQ-MIO (U300.A15), ZHSD-ETHERNET (R1103.1 R1107.2)
ETH_TX_CLK: ZHSD-ZYNQ-MIO (R811.1), ZHSD-ETHERNET (U1100.20)
ETH_TX_CTL: ZHSD-ZYNQ-MIO (R816.1), ZHSD-ETHERNET (U1100.19)
ETH_TXD0: ZHSD-ZYNQ-MIO (R812.1), ZHSD-ETHERNET (U1100.18)
ETH_TXD1: ZHSD-ZYNQ-MIO (R813.1), ZHSD-ETHERNET (U1100.17)
ETH_TXD2: ZHSD-ZYNQ-MIO (R814.1), ZHSD-ETHERNET (U1100.16)
ETH_TXD3: ZHSD-ZYNQ-MIO (R815.1), ZHSD-ETHERNET (U1100.15)
HDMI_CLK: ZHSD-ZYNQ-PL (U300.N17), ZHSD-HDMI (U1500.79)
HDMI_D0: ZHSD-ZYNQ-PL (U300.V16), ZHSD-HDMI (U1500.88)
HDMI_D1: ZHSD-ZYNQ-PL (U300.V17), ZHSD-HDMI (U1500.87)
HDMI_D2: ZHSD-ZYNQ-PL (U300.W16), ZHSD-HDMI (U1500.86)
HDMI_D3: ZHSD-ZYNQ-PL (U300.V18), ZHSD-HDMI (U1500.85)
HDMI_D4: ZHSD-ZYNQ-PL (U300.U18), ZHSD-HDMI (U1500.84)
HDMI_D5: ZHSD-ZYNQ-PL (U300.R17), ZHSD-HDMI (U1500.83)
HDMI_D6: ZHSD-ZYNQ-PL (U300.Y18), ZHSD-HDMI (U1500.82)
HDMI_D7: ZHSD-ZYNQ-PL (U300.W18), ZHSD-HDMI (U1500.81)
HDMI_D8: ZHSD-ZYNQ-PL (U300.P18), ZHSD-HDMI (U1500.80)
HDMI_D9: ZHSD-ZYNQ-PL (U300.Y19), ZHSD-HDMI (U1500.78)
HDMI_D10: ZHSD-ZYNQ-PL (U300.T20), ZHSD-HDMI (U1500.74)
HDMI_D11: ZHSD-ZYNQ-PL (U300.R18), ZHSD-HDMI (U1500.73)
HDMI_D12: ZHSD-ZYNQ-PL (U300.W20), ZHSD-HDMI (U1500.72)
HDMI_D13: ZHSD-ZYNQ-PL (U300.V20), ZHSD-HDMI (U1500.71)
HDMI_D14: ZHSD-ZYNQ-PL (U300.P19), ZHSD-HDMI (U1500.70)
HDMI_D15: ZHSD-ZYNQ-PL (U300.P20), ZHSD-HDMI (U1500.69)
HDMI_DE: ZHSD-ZYNQ-PL (U300.U15), ZHSD-HDMI (U1500.97)
HDMI_HSYNC: ZHSD-ZYNQ-PL (U300.T17), ZHSD-HDMI (U1500.98)
HDMI_I2C_SCL: ZHSD-ZYNQ-PL (U300.N20), ZHSD-HDMI (R1506.1 U1500.55)
HDMI_I2C_SDA: ZHSD-ZYNQ-PL (U300.N18), ZHSD-HDMI (R1507.1 U1500.56)
HDMI_INT: ZHSD-ZYNQ-PL (U300.U19), ZHSD-HDMI (R1508.1 U1500.45)
HDMI_SPDIF: ZHSD-ZYNQ-PL (U300.W19), ZHSD-HDMI (U1500.10)
HDMI_SPDIF_OUT: ZHSD-ZYNQ-PL (U300.U20), ZHSD-HDMI (U1500.46)
HDMI_VSYNC: ZHSD-ZYNQ-PL (U300.R16), ZHSD-HDMI (U1500.2)
LP_CLK_N: ZHSD-ZYNQ-PL (U300.V8), ZHSD-MIPI-CSI2 (R1608.2)
LP_CLK_P: ZHSD-ZYNQ-PL (U300.U8), ZHSD-MIPI-CSI2 (R1610.2)
LP_LANE0_N: ZHSD-ZYNQ-PL (U300.Y13), ZHSD-MIPI-CSI2 (R1600.2)
LP_LANE0_P: ZHSD-ZYNQ-PL (U300.W10), ZHSD-MIPI-CSI2 (R1602.2)
LP_LANE1_N: ZHSD-ZYNQ-PL (U300.W8), ZHSD-MIPI-CSI2 (R1603.2)
LP_LANE1_P: ZHSD-ZYNQ-PL (U300.W9), ZHSD-MIPI-CSI2 (R1607.2)
MIPI_CLK_N: ZHSD-ZYNQ-PL (U300.Y7), ZHSD-MIPI-CSI2 (J1600.8 R1608.1 R1609.2)
MIPI_CLK_P: ZHSD-ZYNQ-PL (U300.Y6), ZHSD-MIPI-CSI2 (J1600.9 R1609.1 R1610.1)
MIPI_LANE0_N: ZHSD-ZYNQ-PL (U300.W11), ZHSD-MIPI-CSI2 (J1600.2 R1600.1 R1601.2)
MIPI_LANE0_P: ZHSD-ZYNQ-PL (U300.Y11), ZHSD-MIPI-CSI2 (J1600.3 R1601.1 R1602.1)
MIPI_LANE1_N: ZHSD-ZYNQ-PL (U300.Y9), ZHSD-MIPI-CSI2 (J1600.5 R1603.1 R1606.2)
MIPI_LANE1_P: ZHSD-ZYNQ-PL (U300.Y8), ZHSD-MIPI-CSI2 (J1600.6 R1606.1 R1607.1)
OTG_CLK: ZHSD-ZYNQ-MIO (U300.A11), ZHSD-USB-OTG (U1000.1)
OTG_DATA0: ZHSD-ZYNQ-MIO (U300.A14), ZHSD-USB-OTG (U1000.3)
OTG_DATA1: ZHSD-ZYNQ-MIO (U300.D15), ZHSD-USB-OTG (U1000.4)
OTG_DATA2: ZHSD-ZYNQ-MIO (U300.A12), ZHSD-USB-OTG (U1000.5)
OTG_DATA3: ZHSD-ZYNQ-MIO (U300.F12), ZHSD-USB-OTG (U1000.6)
OTG_DATA4: ZHSD-ZYNQ-MIO (U300.C16), ZHSD-USB-OTG (U1000.7)
OTG_DATA5: ZHSD-ZYNQ-MIO (U300.A10), ZHSD-USB-OTG (U1000.9)
OTG_DATA6: ZHSD-ZYNQ-MIO (U300.E13), ZHSD-USB-OTG (U1000.10)
OTG_DATA7: ZHSD-ZYNQ-MIO (U300.C18), ZHSD-USB-OTG (U1000.13)
OTG_DIR: ZHSD-ZYNQ-MIO (U300.C13), ZHSD-USB-OTG (U1000.31)
OTG_NXT: ZHSD-ZYNQ-MIO (U300.E16), ZHSD-USB-OTG (U1000.2)
OTG_RST: ZHSD-ZYNQ-MIO (U300.D14), ZHSD-USB-OTG (R1001.1 U1000.27)
OTG_STP: ZHSD-ZYNQ-MIO (U300.C15), ZHSD-USB-OTG (U1000.29)
PL_CLK_125: ZHSD-ETHERNET (R1121.2), ZHSD-ZYNQ-PL (U300.K17)
PS_QSPI_IO0_M3: ZHSD-BOOT-STORAGE (R912.2 U901.5), ZHSD-ZYNQ-MIO (U300.B8)
PS_QSPI_IO1_M1: ZHSD-BOOT-STORAGE (R914.2 U901.2), ZHSD-ZYNQ-MIO (U300.D6)
PS_QSPI_IO2_M2: ZHSD-BOOT-STORAGE (R915.2 U901.3), ZHSD-ZYNQ-MIO (U300.B7)
PS_QSPI_IO3_M0: ZHSD-BOOT-STORAGE (R911.2 U901.7), ZHSD-ZYNQ-MIO (U300.A6)
PS_QSPI_SCK_M4: ZHSD-BOOT-STORAGE (R913.2 U901.6), ZHSD-ZYNQ-MIO (R806.1)
PS_QSPI_SS: ZHSD-BOOT-STORAGE (R908.1 U901.1), ZHSD-ZYNQ-MIO (U300.A7)
PS_SD_CLK: ZHSD-BOOT-STORAGE (R900.1 U900.M6), ZHSD-ZYNQ-MIO (R809.1)
PS_SD_CMD: ZHSD-BOOT-STORAGE (R901.1 U900.M5), ZHSD-ZYNQ-MIO (U300.C6)
PS_SD_IO0: ZHSD-BOOT-STORAGE (R905.1 U900.A3), ZHSD-ZYNQ-MIO (U300.E9)
PS_SD_IO1: ZHSD-BOOT-STORAGE (R904.1 U900.A4), ZHSD-ZYNQ-MIO (U300.E8)
PS_SD_IO2: ZHSD-BOOT-STORAGE (R903.1 U900.A5), ZHSD-ZYNQ-MIO (U300.C5)
PS_SD_IO3: ZHSD-BOOT-STORAGE (R902.1 U900.B2), ZHSD-ZYNQ-MIO (U300.C8)
RSCAN.CAN_RX: ZHSD-ZYNQ-MIO (U300.B15), ZHSD-RS485-CAN (U1301.B3)
RSCAN.CAN_STB: ZHSD-ZYNQ-MIO (U300.A9), ZHSD-RS485-CAN (U1301.C3)
RSCAN.CAN_TX: ZHSD-ZYNQ-MIO (U300.F13), ZHSD-RS485-CAN (U1301.A3)
RSCAN.RS485_DE: ZHSD-ZYNQ-MIO (U300.B5), ZHSD-RS485-CAN (U1302.2 U1302.3)
RSCAN.RS485_RX: ZHSD-ZYNQ-MIO (U300.D16), ZHSD-RS485-CAN (Q1300.2 R1302.2)
RSCAN.RS485_TX: ZHSD-ZYNQ-MIO (U300.B14), ZHSD-RS485-CAN (Q1301.2 R1306.2)
SD_RST: ZHSD-BOOT-STORAGE (R907.1), ZHSD-ZYNQ-MIO (Q800.3)
SE35.L3_35_N: ZHSD-ZYNQ-PL (U300.F19), ZHSD-PL-CONNS (J1701.23)
SE35.L3_35_P: ZHSD-ZYNQ-PL (U300.D19), ZHSD-PL-CONNS (J1701.21)
SE35.L5_35_N: ZHSD-ZYNQ-PL (U300.G20), ZHSD-PL-CONNS (J1701.29)
SE35.L5_35_P: ZHSD-ZYNQ-PL (U300.G19), ZHSD-PL-CONNS (J1701.27)
SE35.L6_35_N: ZHSD-ZYNQ-PL (U300.J18), ZHSD-PL-CONNS (J1701.35)
SE35.L6_35_P: ZHSD-ZYNQ-PL (U300.H17), ZHSD-PL-CONNS (J1701.33)
SE35.L7_35_N: ZHSD-ZYNQ-PL (U300.L20), ZHSD-PL-CONNS (J1701.41)
SE35.L7_35_P: ZHSD-ZYNQ-PL (U300.K19), ZHSD-PL-CONNS (J1701.39)
SE35.L8_35_N: ZHSD-ZYNQ-PL (U300.M18), ZHSD-PL-CONNS (J1701.47)
SE35.L8_35_P: ZHSD-ZYNQ-PL (U300.M19), ZHSD-PL-CONNS (J1701.45)
SE35.L14_35_N: ZHSD-ZYNQ-PL (U300.E19), ZHSD-PL-CONNS (J1701.24)
SE35.L14_35_P: ZHSD-ZYNQ-PL (U300.D18), ZHSD-PL-CONNS (J1701.22)
SE35.L16_35_N: ZHSD-ZYNQ-PL (U300.G18), ZHSD-PL-CONNS (J1701.30)
SE35.L16_35_P: ZHSD-ZYNQ-PL (U300.F17), ZHSD-PL-CONNS (J1701.28)
SE35.L17_35_N: ZHSD-ZYNQ-PL (U300.H20), ZHSD-PL-CONNS (J1701.36)
SE35.L17_35_P: ZHSD-ZYNQ-PL (U300.H18), ZHSD-PL-CONNS (J1701.34)
SE35.L18_35_N: ZHSD-ZYNQ-PL (U300.L19), ZHSD-PL-CONNS (J1701.42)
SE35.L18_35_P: ZHSD-ZYNQ-PL (U300.J20), ZHSD-PL-CONNS (J1701.40)
SE35.L19_35_N: ZHSD-ZYNQ-PL (U300.M17), ZHSD-PL-CONNS (J1701.48)
SE35.L19_35_P: ZHSD-ZYNQ-PL (U300.M20), ZHSD-PL-CONNS (J1701.46)
SE35.L20_35_P: ZHSD-ZYNQ-PL (U300.N16), ZHSD-PL-CONNS (J1701.52)
TCK_0: ZHSD-ZYNQ-CONFIG (R400.1 U300.J6), ZHSD-JTAG (R500.2 R505.1)
TDI_0: ZHSD-ZYNQ-CONFIG (U300.G6), ZHSD-JTAG (R502.2 R507.1)
TDO_0: ZHSD-ZYNQ-CONFIG (U300.F6), ZHSD-JTAG (R501.2 R506.1)
TMS_0: ZHSD-ZYNQ-CONFIG (R401.1 U300.F9), ZHSD-JTAG (R503.2 R509.1)
USB_UART_RX: ZHSD-ZYNQ-MIO (U300.C12), ZHSD-USB-UART (Q1200.2 R1201.2)
USB_UART_TX: ZHSD-ZYNQ-MIO (U300.B12), ZHSD-USB-UART (Q1201.2 R1204.2)